# EAGLE schematic LTTO-medic-remote (EAGLE 6.5.0)
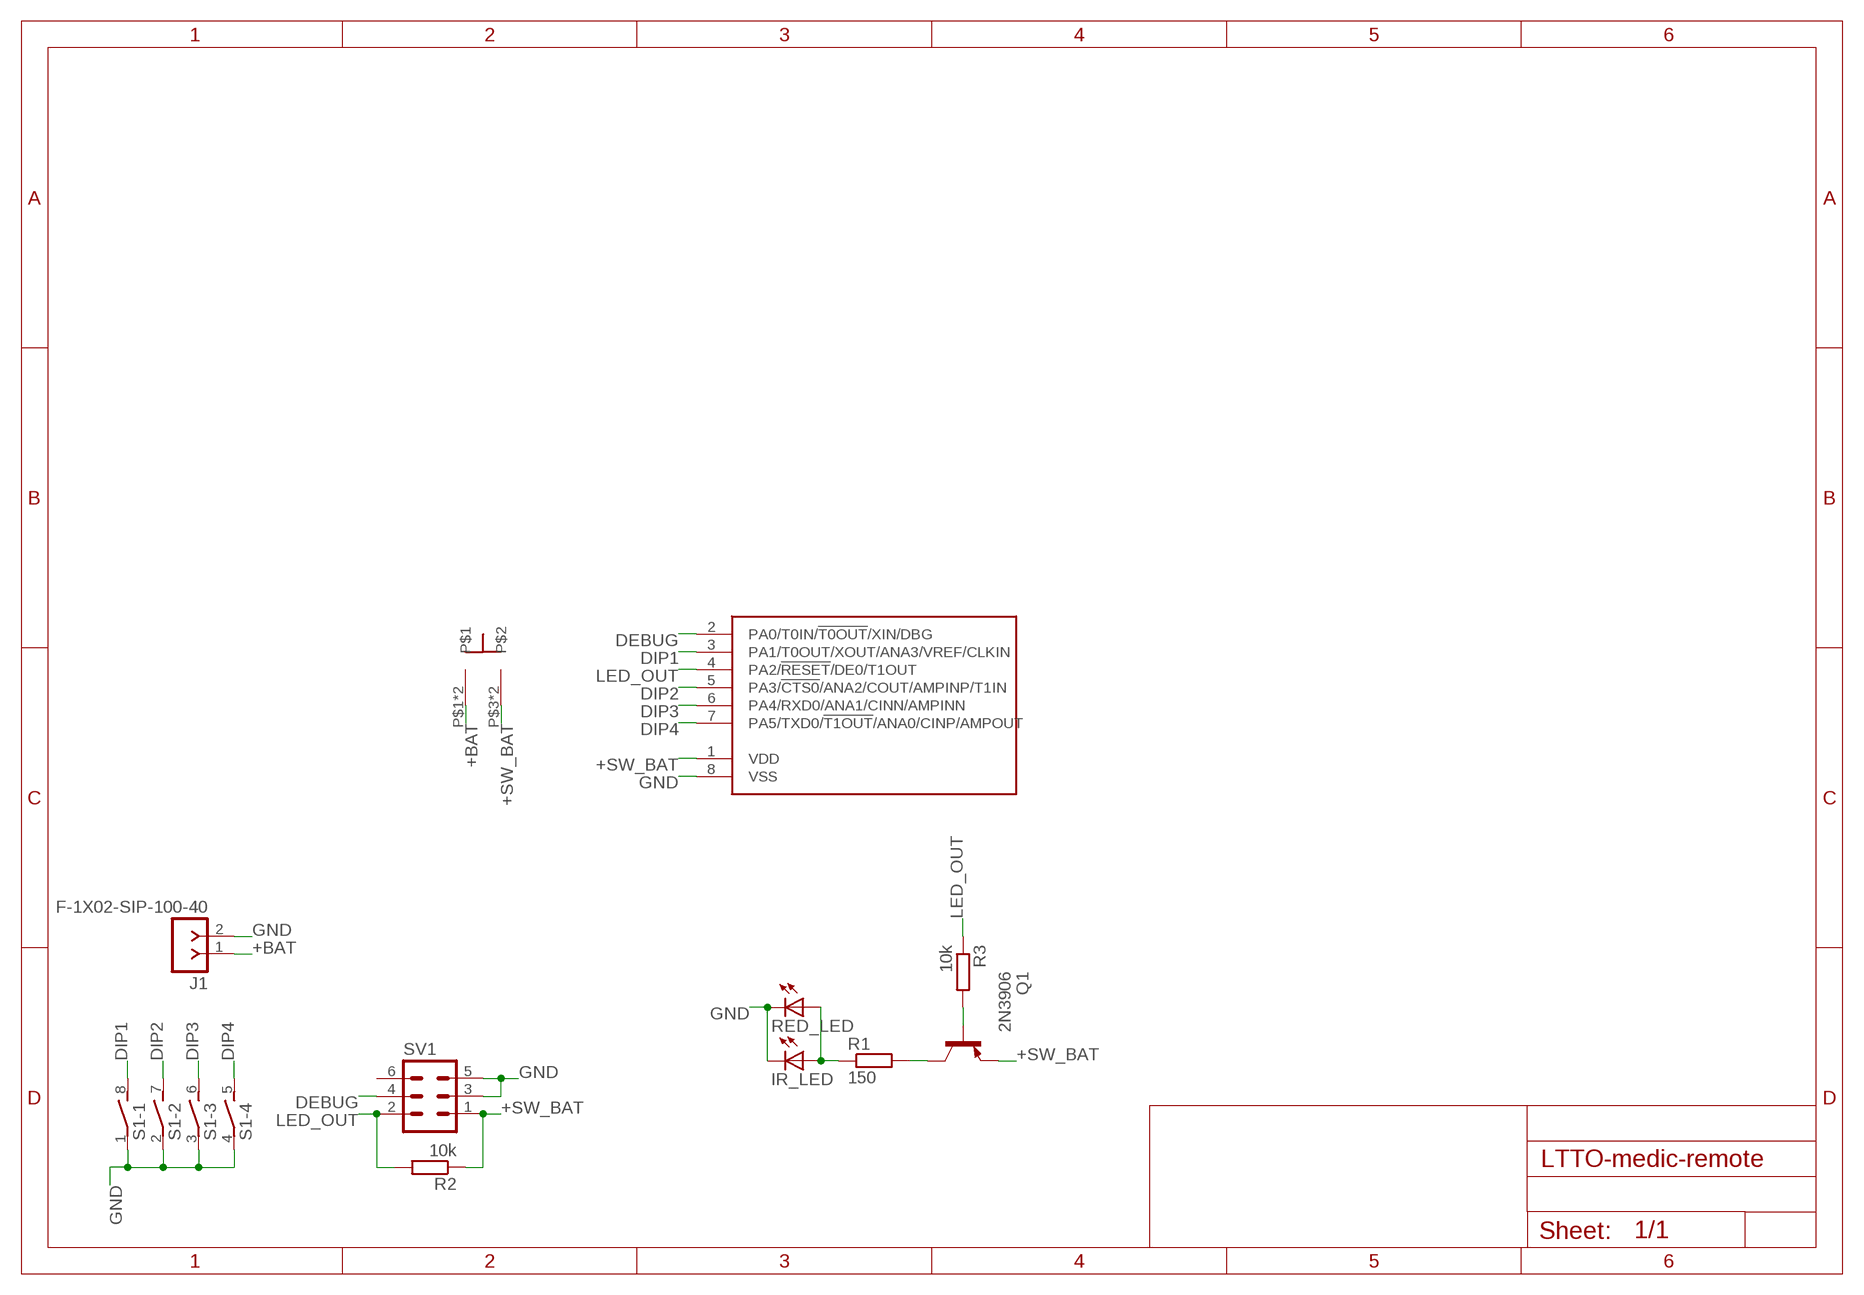
[diagram p0: schematic, sheet 1]

## Parts
IR_LED  LED5MM  [LED5MM]
J1  F-1X02-SIP-100-40  [SIP-100-02-40]
Q1  2N3906  [TO92]
R1  150  R-EU_0204/7  [0204/7]
R2  10k  R-EU_0204/7  [0204/7]
R3  10k  R-EU_0204/7  [0204/7]
RED_LED  LED5MM  [LED5MM]
S1  DIP04S  [DIP04S]
SV1  MA03-2  [MA03-2]
U$1  Z8F082ADIL-8  [DIL8]
U$2  PUSHBUTTON  [PUSHBUTTON]

## Nets
+BAT: J1.1 U$2.P$1 U$2.P$2
+SW_BAT: Q1.3(E) R2.1 SV1.1 U$1.1(VDD) U$2.P$3 U$2.P$4
DEBUG: SV1.4 U$1.2(PA0/T0IN/!T0OUT!/XIN/DBG)
DIP1: S1.8 U$1.3(PA1/T0OUT/XOUT/ANA3/VREF/CLKIN)
DIP2: S1.7 U$1.5(PA3/!CTS0!/ANA2/COUT/AMPINP/T1IN)
DIP3: S1.6 U$1.6(PA4/RXD0/ANA1/CINN/AMPINN)
DIP4: S1.5 U$1.7(PA5/TXD0/!T1OUT!/ANA0/CINP/AMPOUT)
GND: IR_LED.K(C) J1.2 RED_LED.K(C) S1.1 S1.2 S1.3 S1.4 SV1.3 SV1.5 U$1.8(VSS)
LED_OUT: R2.2 R3.1 SV1.2 U$1.4(PA2/!RESET!/DE0/T1OUT)
N$1: Q1.1(C) R1.2
N$2: IR_LED.A R1.1 RED_LED.A
N$3: Q1.2(B) R3.2
Unconnected: SV1.6

## Library data of the parts
IR_LED RED_LED = led:LED: LED OSRAM: - CHIPLED LG R971, LG N971, LY N971, LG Q971, LY Q971, LO R971, LY R971 LH N974, LH R974 LS Q976, LO Q976, LY Q976 LO Q996 - Hyper CHIPLED LW Q18S LB Q993, LB Q99A, LB R99A - SideLED LS A670, LO A670, LY A670, LG A670, LP A670 LB A673, LV A673, LT A673, LW A673 LH A674 LY A675 LS A676, LA A676, LO A676, LY A676, LW A676 LS A679, LY A679, LG A679 - Hyper Micro SIDELED® LS Y876, LA Y876, LO Y876, LY Y876 LT Y87S - SmartLED LW L88C, LW L88S LB L89C, LB L89S, LG L890 LS L89K, LO L89K, LY L89K LS L896, LA L896, LO L896, LY L896 - TOPLED LS T670, LO T670, LY T670, LG T670, LP T670 LSG T670, LSP T670, LSY T670, LOP T670, LYG T670 LG T671, LOG T671, LSG T671 LB T673, LV T673, LT T673, LW T673 LH T674 LS T676, LA T676, LO T676, LY T676, LB T676, LH T676, LSB T676, LW T676 LB T67C, LV T67C, LT T67C, LS T67K, LO T67K, LY T67K, LW E67C LS E67B, LA E67B, LO E67B, LY E67B, LB E67C, LV E67C, LT E67C LW T67C LS T679, LY T679, LG T679 LS T770, LO T770, LY T770, LG T770, LP T770 LB T773, LV T773, LT T773, LW T773 LH T774 LS E675, LA E675, LY E675, LS T675 LS T776, LA T776, LO T776, LY T776, LB T776 LHGB T686 LT T68C, LB T68C - Hyper Mini TOPLED® LB M676 - Mini TOPLED Santana® LG M470 LS M47K, LO M47K, LY M47K Source: http://www.osram.convergy.de LUXEON: - LUMILED® LXK2-PW12-R00, LXK2-PW12-S00, LXK2-PW14-U00, LXK2-PW14-V00 LXK2-PM12-R00, LXK2-PM12-S00, LXK2-PM14-U00 LXK2-PE12-Q00, LXK2-PE12-R00, LXK2-PE12-S00, LXK2-PE14-T00, LXK2-PE14-U00 LXK2-PB12-K00, LXK2-PB12-L00, LXK2-PB12-M00, LXK2-PB14-N00, LXK2-PB14-P00, LXK2-PB14-Q00 LXK2-PR12-L00, LXK2-PR12-M00, LXK2-PR14-Q00, LXK2-PR14-R00 LXK2-PD12-Q00, LXK2-PD12-R00, LXK2-PD12-S00 LXK2-PH12-R00, LXK2-PH12-S00 LXK2-PL12-P00, LXK2-PL12-Q00, LXK2-PL12-R00 Source: www.luxeon.com KINGBRIGHT: KA-3528ASYC Source: www.kingbright.com
J1 = con-headers-jp:F-1X02-: FEMALE HEADER
Q1 = transistor-pnp:2N3906: PNP Transistor
R1-R3 = resistor:R-EU_: RESISTOR, European symbol
S1 = switch-dil:DIP04S: DIL/CODE SWITCH; OC_FARNELL: unknown; OC_NEWARK: unknown
SV1 = izzy:MA03-2: PIN HEADER; OC_FARNELL: unknown; OC_NEWARK: unknown
U$1 = izzy:Z8F082A: Zilog Z8F082A-SO08
U$2 = izzy:PUSHBUTTON